# Altium schematic sheet Power module.SchDoc
size 410 x 297 mm
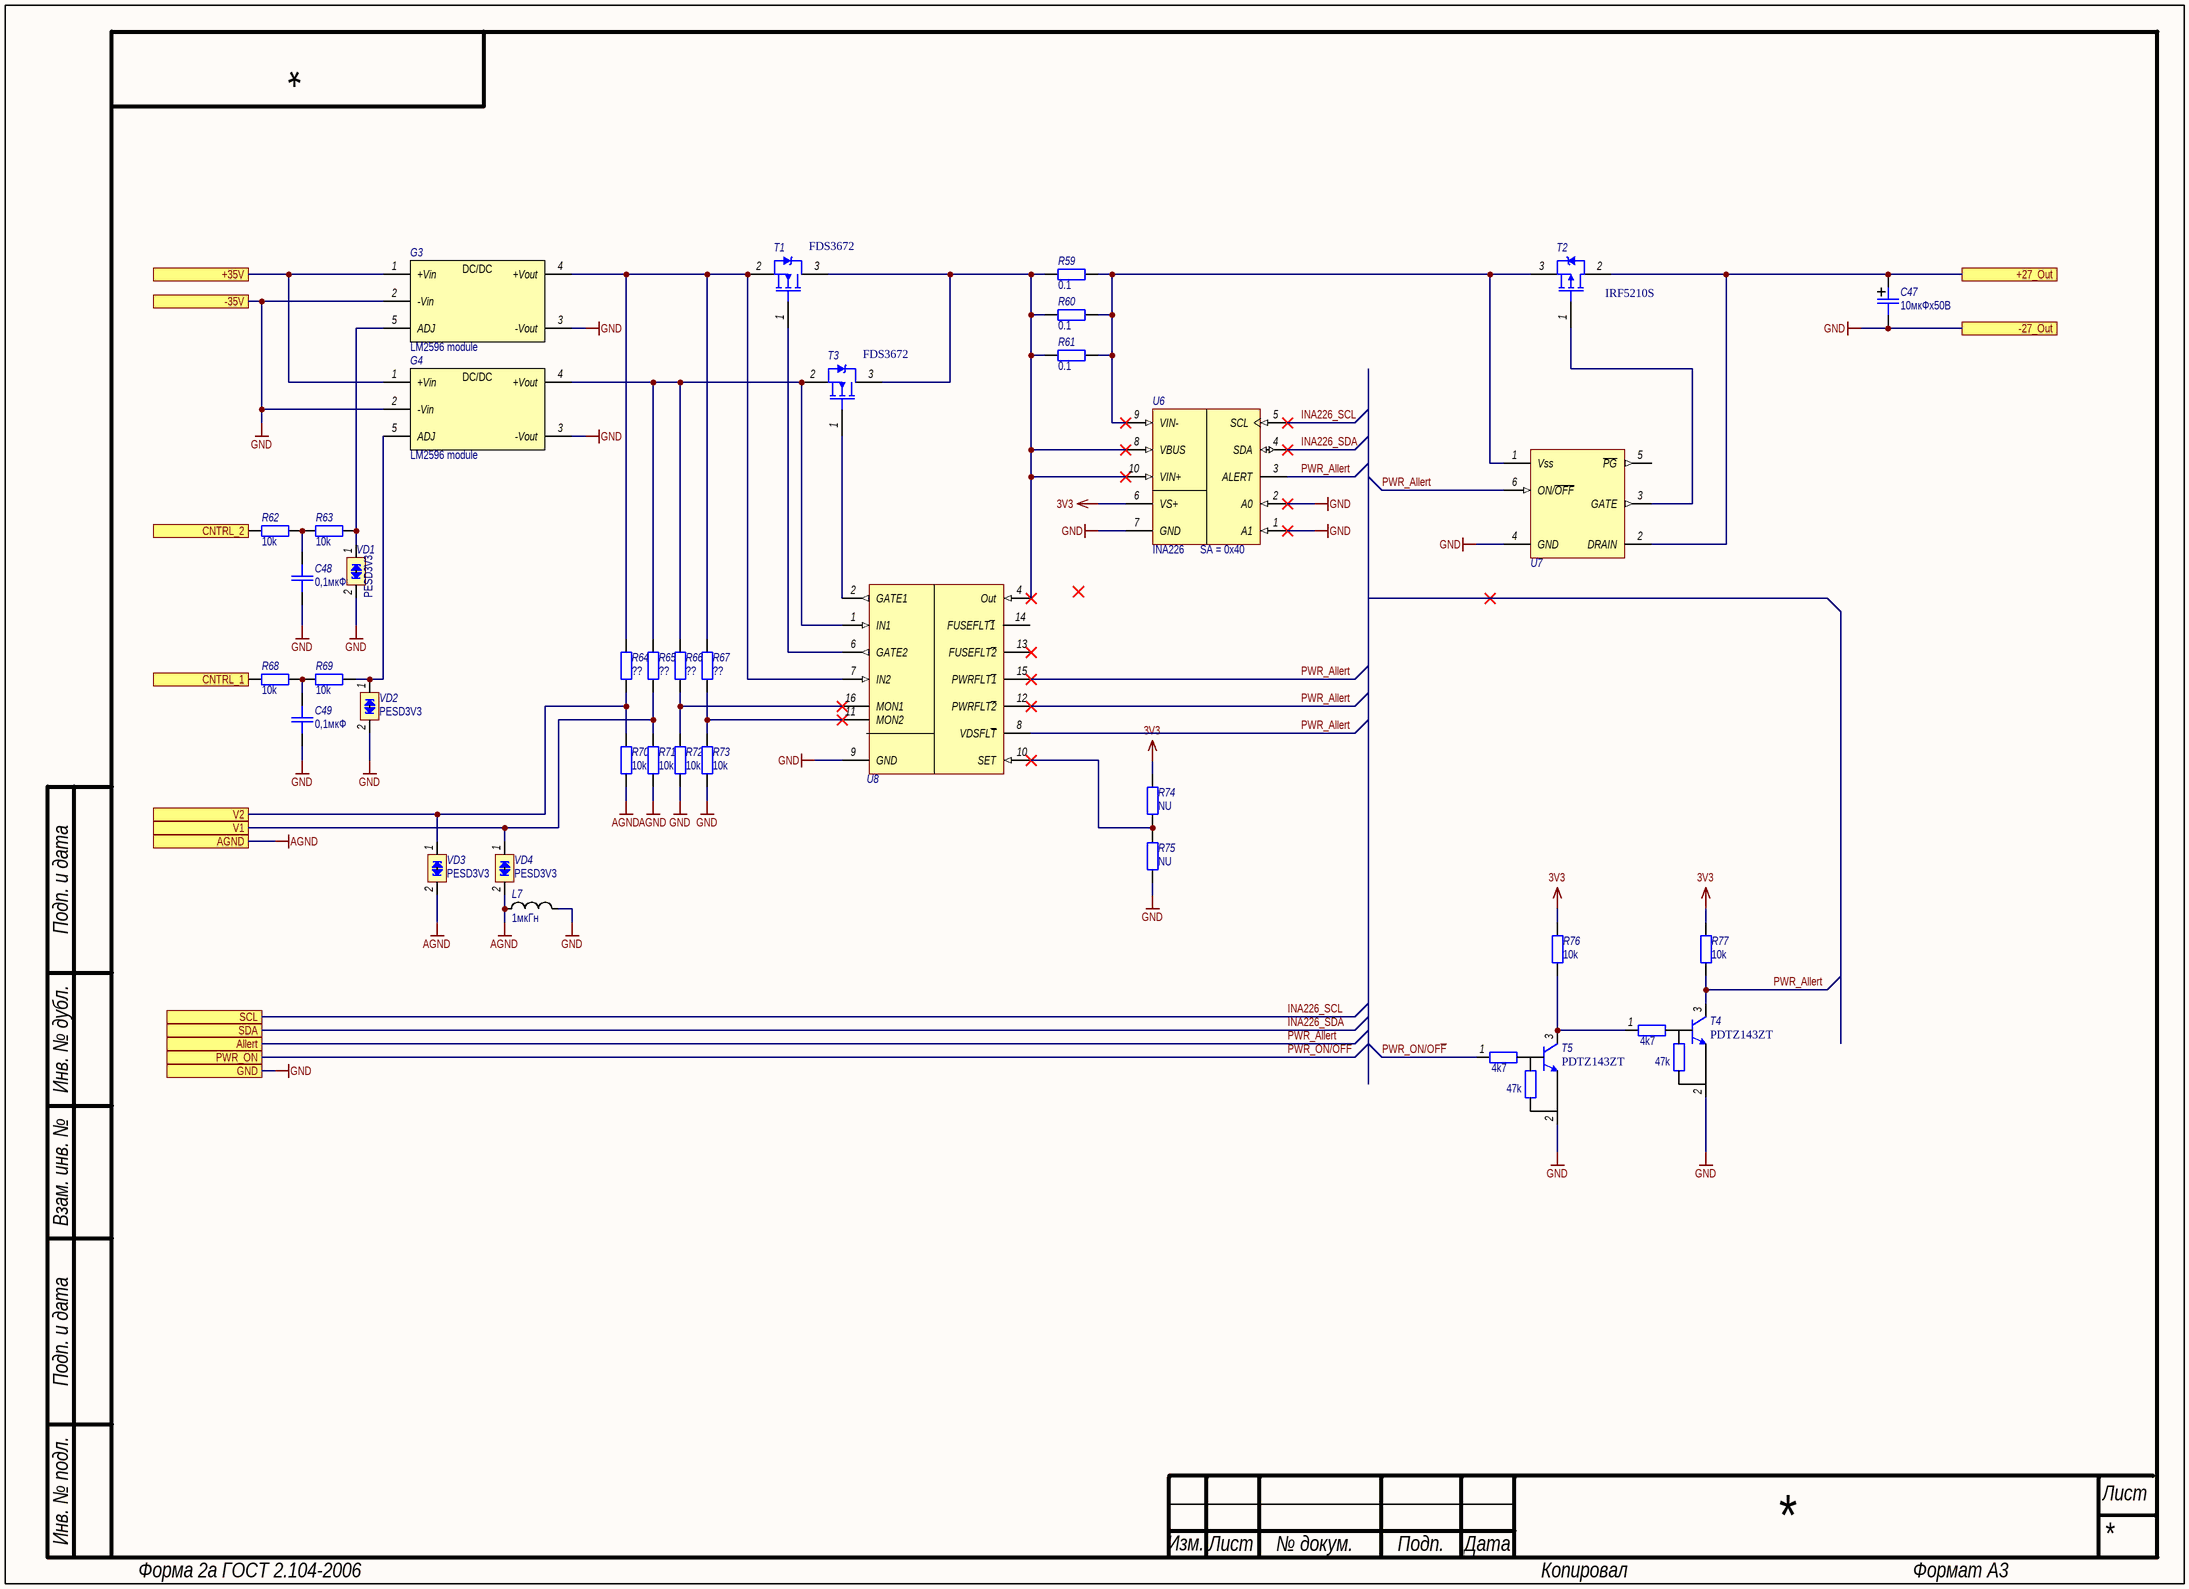
[diagram p0: Power module.SchDoc]

## Parts
C47  10мкФх50В  [SMD_size_C]
C48  0,1мкФ  [SMD_0805]
C49  0,1мкФ  [SMD_0805]
G3  LM2596  [LM2596 module]  (value not drawn)
G4  LM2596  [LM2596 module]  (value not drawn)
L7  1мкГн  [SMD_0805]
R59  0.1  [SMD_0805]
R60  0.1  [SMD_0805]
R61  0.1  [SMD_0805]
R62  10k  [SMD_0805]
R63  10k  [SMD_0805]
R64  ??  [SMD_0805]
R65  ??  [SMD_0805]
R66  ??  [SMD_0805]
R67  ??  [SMD_0805]
R68  10k  [SMD_0805]
R69  10k  [SMD_0805]
R70  10k  [SMD_0805]
R71  10k  [SMD_0805]
R72  10k  [SMD_0805]
R73  10k  [SMD_0805]
R74  NU  [SMD_0805]
R75  NU  [SMD_0805]
R76  10k  [SMD_0805]
R77  10k  [SMD_0805]
T1  FDS3672  [SO-8 Transistor]
T2  IRF5210S  [D2Pak]
T3  FDS3672  [SO-8 Transistor]
T4  PDTZ143ZT  [SOT-23]
T5  PDTZ143ZT  [SOT-23]
U6  INA226  [VSSOP-10]
U7  MAX5902  [SOT23-6]  (value not drawn)
U8  LTC4355  [MSOP16]  (value not drawn)
VD1  PESD3V3  [SOD-323]
VD2  PESD3V3  [SOD-323]
VD3  PESD3V3  [SOD-323]
VD4  PESD3V3  [SOD-323]

## Ports
+27_Out, +35V, -27_Out, -35V, AGND, Allert, CNTRL_1, CNTRL_2, GND, PWR_ON, SCL, SDA, V1, V2

## Nets
3V3: R74.2 R76.2 R77.2 U6.6(VS+)
AGND: L7.1 R70.1 R71.1 VD3.2(cathode_2) VD4.2(cathode_2) ; port AGND
GND: C47.2 C48.1 C49.1 G3.2(-Vin) G3.3(-Vout) G4.2(-Vin) G4.3(-Vout) L7.2 R72.1 R73.1 R75.1 T4.2(E) T5.2(E) U6.1(A1) U6.2(A0) U6.7(GND) U7.4(GND) U8.9(GND) VD1.2(cathode_2) VD2.2(cathode_2) ; port -35V, port -27_Out, port GND
+27_Out: C47.1 T2.2(D) U7.2(DRAIN) ; port +27_Out
+35V: G3.1(+Vin) G4.1(+Vin) ; port +35V
CNTRL_1: R68.2 ; port CNTRL_1
CNTRL_2: R62.2 ; port CNTRL_2
INA226_SCL: U6.5(SCL) ; port SCL
INA226_SDA: U6.4(SDA) ; port SDA
PWR_Allert: R77.1 T4.3(C) U6.3(ALERT) U7.6(ON/~{OFF}) U8.8(VDSFL~{T}) U8.12(PWRFLT~{2}) U8.15(PWRFLT~{1}) ; port Allert
PWR_ON/OF~{F}: T5.1(B) ; port PWR_ON
V1: R65.1 R71.2 VD4.1(cathode_1) ; port V1
V2: R64.1 R70.2 VD3.1(cathode_1) ; port V2
NetC48_2: C48.2 R62.1 R63.2
NetC49_2: C49.2 R68.1 R69.2
NetG3_4: G3.4(+Vout) R64.2 R67.2 T1.2(D) U8.7(IN2)
NetG3_5: G3.5(ADJ) R63.1 VD1.1(cathode_1)
NetG4_4: G4.4(+Vout) R65.2 R66.2 T3.2(D) U8.1(IN1)
NetG4_5: G4.5(ADJ) R69.1 VD2.1(cathode_1)
NetR59_1: R59.1 R60.1 R61.1 T2.3(S) U6.9(VIN-) U7.1(Vss)
NetR59_2: R59.2 R60.2 R61.2 T1.3(S) T3.3(S) U6.8(VBUS) U6.10(VIN+) U8.4(Out)
NetR66_1: R66.1 R72.2 U8.16(MON1)
NetR67_1: R67.1 R73.2 U8.11(MON2)
NetR74_1: R74.1 R75.2 U8.10(SET)
NetR76_1: R76.1 T4.1(B) T5.3(C)
NetT1_1: T1.1(G) U8.6(GATE2)
NetT2_1: T2.1(G) U7.3(GATE)
NetT3_1: T3.1(G) U8.2(GATE1)

Not connected (* = marked no-connect by the designer): U7 5(~{PG}); U8 13(FUSEFLT~{2})* 14(FUSEFLT~{1})

## Notes on the sheet
- (near U6) SA = 0x40
- Подп. и дата
- Инв. № дубл.
- Взам. инв. №
- Инв. № подл.
- Изм.
- Лист
- № докум.
- Подп.
- Дата
- Форма 2а ГОСТ 2.104-2006
- Копировал
- Формат А3
- (in symbol LM2596) DC/DC
- (in symbol PDTZ143ZT) 4k7; 47k

## Library data of the parts
C47 = Capacitor_pol: Polarized capacitor; Назначение: Поляризованный SMD-конденсатор; Наименование: Поляризованный конденсатор; Потребление, Вт: 0; Value: 10мкФх50В
C48 C49 = Capacitor: Назначение: SMD-конденсатор; Наименование: Конденсатор; Потребление, Вт: 0; Value: 0,1мкФ
G3 G4 = LM2596: DC/DC converter; Назначение: DC-DC преобразователь; Потребление, Вт: 20; DataSheet: https://static.chipdip.ru/lib/641/DOC001641867.pdf; Наименование: LM2596 module
L7 = Inductor: Наименование: Индуктивность; Назначение: SMD-индуктивность; Потребление, Вт: 0,010; Value: 1мкГн
R59-R77 = Resistor: Наименование: Резистор; Назначение: SMD-резистор; Потребление, Вт: 0,001; Value: 1к
T1 T3 = FDS3672: N channel Power MosFET; Назначение: Транзистор верхнего плеча, для "идеального" диода; Потребление, Вт: 0,025; Наименование: FDS3672
T2 = IRF5210S: P channel Power MosFET; Назначение: Транзистор P канальный; Потребление, Вт: 0,02; Наименование: IRF5210S
T4 T5 = PDTZ143ZT: Digital Transistor; назначение: транзистор; Потребление, Вт: 0,01; Datasheet: https://static.chipdip.ru/lib/583/DOC001583045.pdf; наименование: PDTZ143ZT
U6 = INA226: High- or Low-Side Measurement, Bidirectional Current and Power Monitor With I2C Interface; Назначение: High-Side or Low-Side Measurement,; Потребление, Вт: 0,001; ComponentLink1Description: Data sheet; ComponentLink1URL: http://www.ti.com/lit/ds/symlink/ina226.pdf; DataSheet: https://www.ti.com/lit/ds/symlink/ina226.pdf?ts=1592809211957&ref_url=https%253A%252F%252Fwww.google.com%252F; Наименование: INA226
U7 = MAX5902: Hot-swap controller; Package Information: Latest Revision: ver11.0, Feb-2003; Configures: APEX II, APEX 20K, Mercury, ACEX 1K & FLEX Devices; Code - JEDEC: MS-026-ABA; Назначение: Драйвер верхнего плеча, драйвер P транзистора; Потребление, Вт: 0,01; Published: 17-Sep-2003; Datasheet: Latest Revision: ver1.1, Oct-2003; Package Reference: TQFP32; Publisher: Altium Limited; Наименование: MAX5902
U8 = LTC4355: Ideal Diode; Назначение: Идеальный диод; Потребление, Вт: 0,02; ComponentLink1Description: Data sheet; ComponentLink1URL: http://www.ti.com/lit/ds/symlink/ina226.pdf; DataSheet: https://www.analog.com/media/en/technical-documentation/data-sheets/4355ff.pdf; Наименование: LTC4355
VD1-VD4 = PESDxL1BA: Low capacitance bidirectional ESD protection diodes; Назначение: ESD защитные диоды; Потребление, Вт: 0.0; Наименование: PESDxL1BA